# EAGLE schematic TSOC_NEOLED_R1_2 (EAGLE 6.6.0)
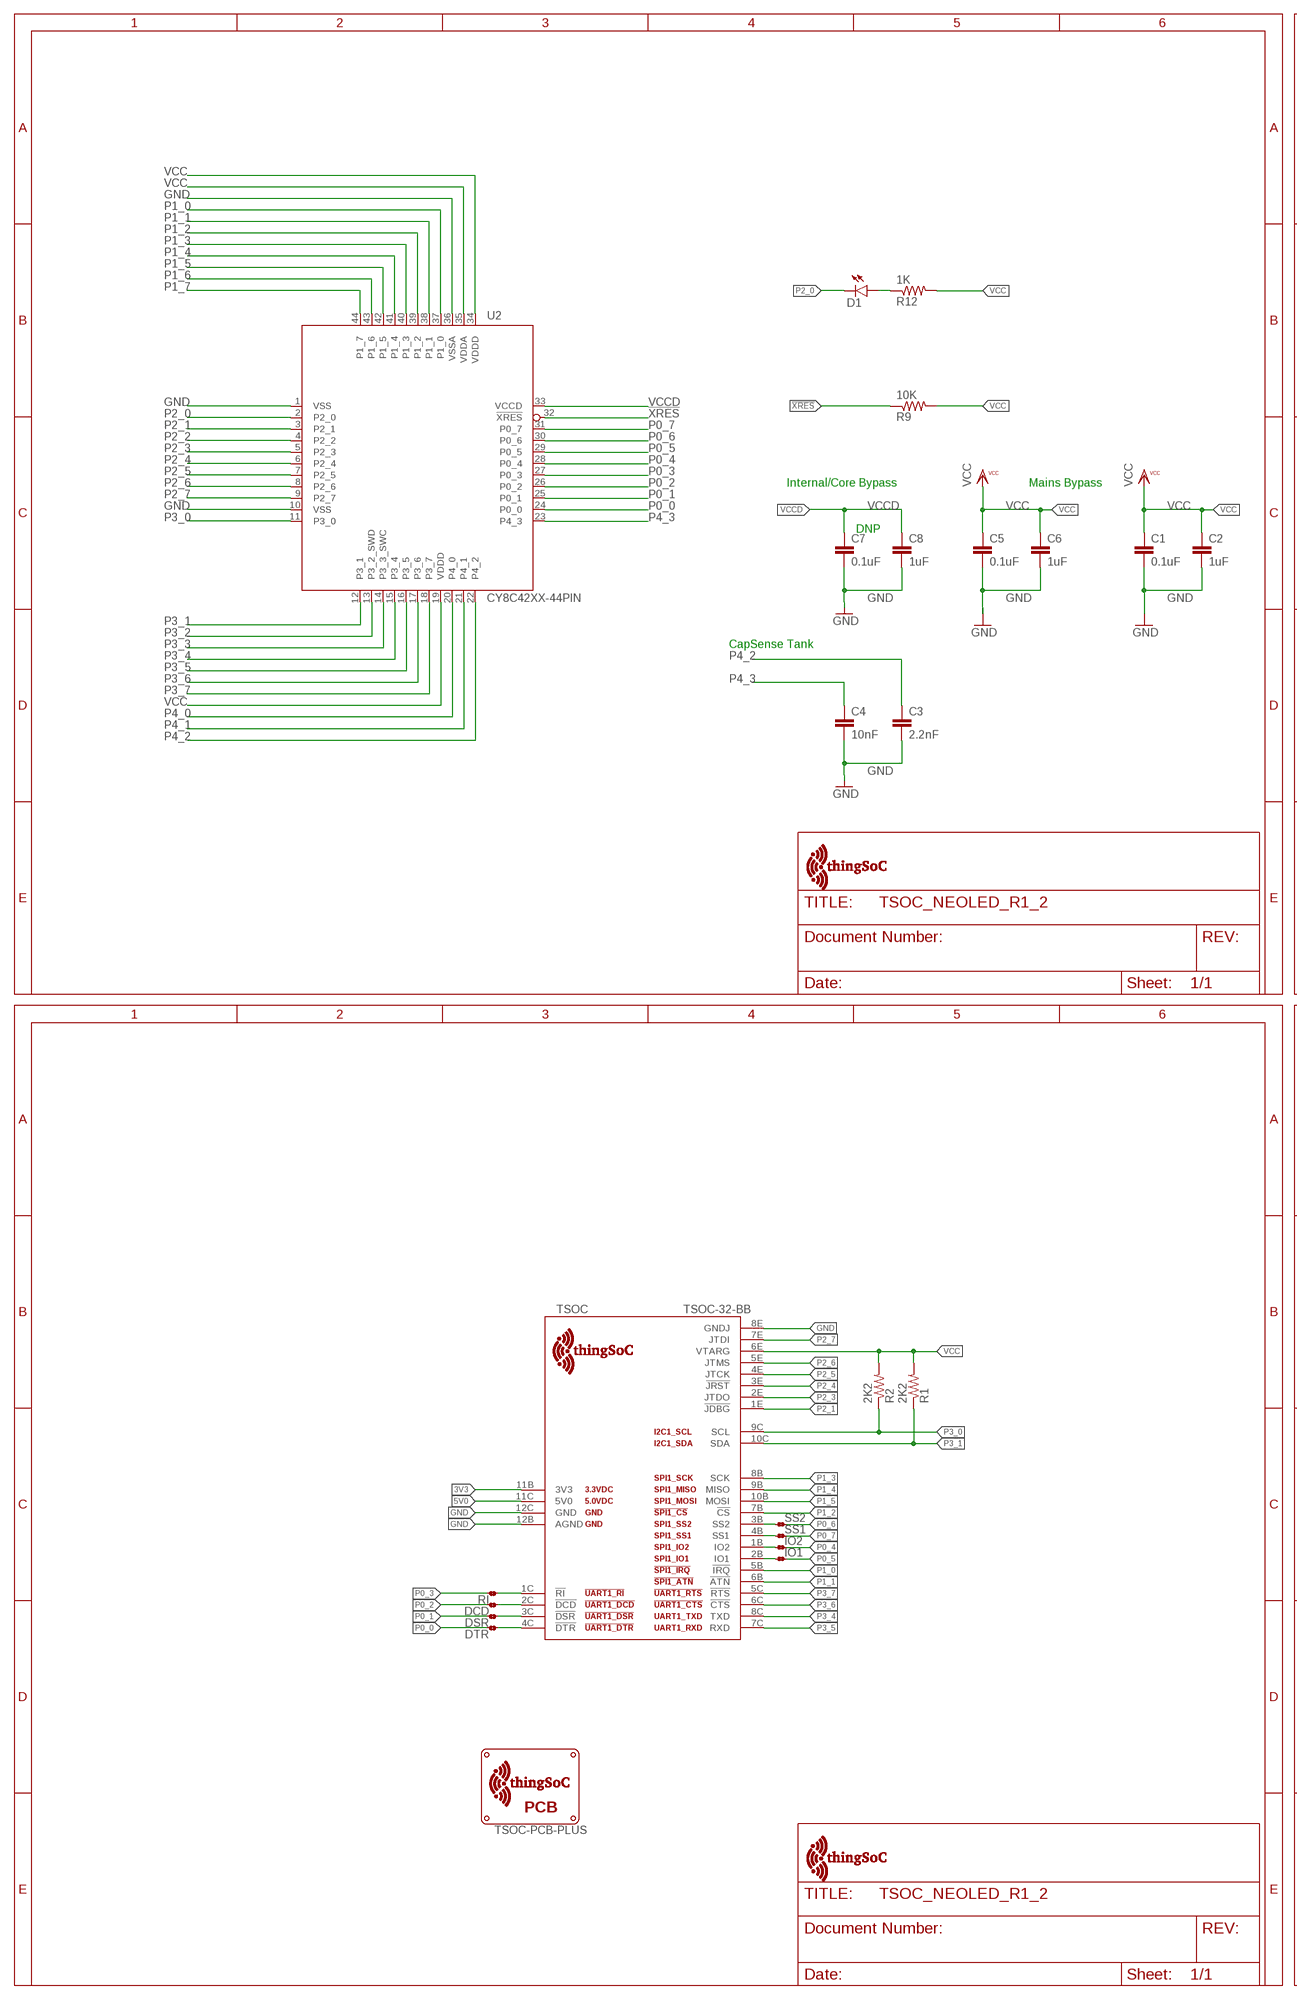
[diagram p0: schematic, sheet 1, part 1 of 2]
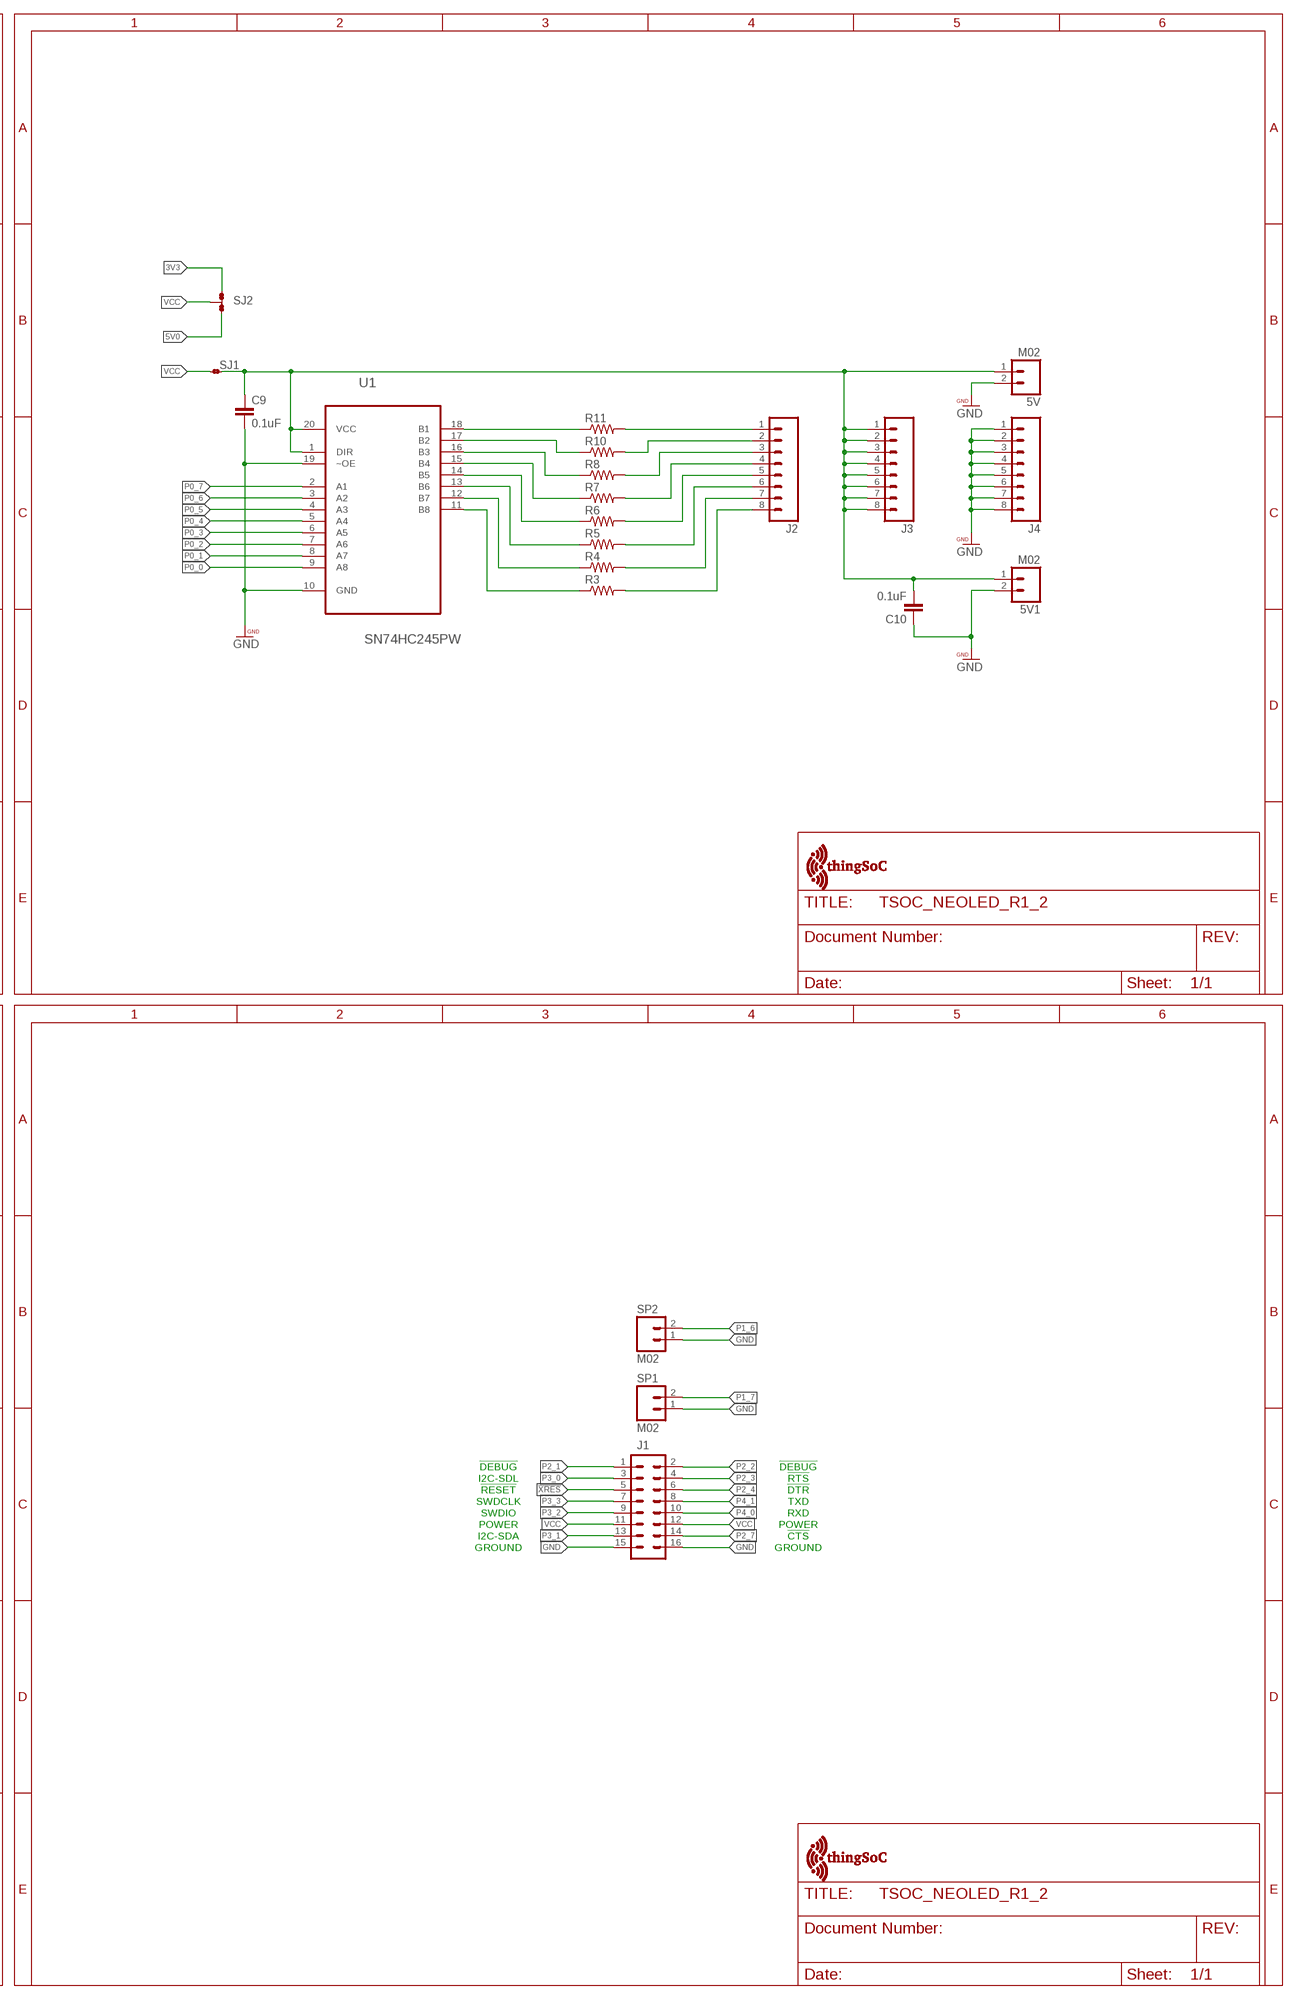
[diagram p1: schematic, sheet 1, part 2 of 2]

## Parts
5V  M02  [1X02]
5V1  M02  [1X02]
$$U$1  TSOC-LOGO-SMALL  [TSOC-LOGO-SML]
$$U$2  TSOC-LOGO-MED  [TSOC-LOGO-MED]
C1  0.1uF  CAP0603-CAP  [0603-CAP]
C2  1uF  CAP0603-CAP  [0603-CAP]
C3  2.2nF  CAP0603-CAP  [0603-CAP]
C4  10nF  CAP0603-CAP  [0603-CAP]
C5  0.1uF  CAP0603-CAP  [0603-CAP]
C6  1uF  CAP0603-CAP  [0603-CAP]
C7  0.1uF  CAP0603-CAP  [0603-CAP]
C8  1uF  CAP0603-CAP  [0603-CAP]
C9  0.1uF  CAP0603-CAP  [0603-CAP]
C10  0.1uF  CAP0603-CAP  [0603-CAP]
D1  LED0603  [LED-0603]
DCD  JMP-2-NO  [JMP-2-NO]
DSR  JMP-2-NO  [JMP-2-NO]
DTR  JMP-2-NO  [JMP-2-NO]
IO1  JMP-2-NO  [JMP-2-NO]
IO2  JMP-2-NO  [JMP-2-NO]
J1  M08X2  [2X8]
J2  M08  [1X08_ROUND]
J3  M08  [1X08_ROUND]
J4  M08  [1X08_ROUND]
R1  2K2  RESISTOR_SFE0603-RES  [0603-RES]
R2  2K2  RESISTOR_SFE0603-RES  [0603-RES]
R3  RESISTOR0603-RES  [0603-RES]
R4  RESISTOR0603-RES  [0603-RES]
R5  RESISTOR0603-RES  [0603-RES]
R6  RESISTOR0603-RES  [0603-RES]
R7  RESISTOR0603-RES  [0603-RES]
R8  RESISTOR0603-RES  [0603-RES]
R9  10K  RESISTOR_SFE0603-RES  [0603-RES]
R10  RESISTOR0603-RES  [0603-RES]
R11  RESISTOR0603-RES  [0603-RES]
R12  1K  RESISTOR_SFE0603-RES  [0603-RES]
RI  JMP-2-NO  [JMP-2-NO]
SJ1  JMP-2-NC  [JMP-2-NC]
SJ2  JMP-3-NC  [JMP-3-NC]
SP1  M02  [1X02]
SP2  M02  [1X02]
SS1  JMP-2-NO  [JMP-2-NO]
SS2  JMP-2-NO  [JMP-2-NO]
TSOC  TSOC-32-BB  [TSOC-BB-S32]
U1  SN74HC245PW  [SOP65P640X120-20N]
U2  CY8C42XX-44PIN  [TQFP-10X10-44]
U$1  TSOC-PCB-PLUS  [TSOC-BB-BRD-PLUS]
U$100  TSOC-LOGO-SMALL  [TSOC-LOGO-SML]
U$101  TSOC-LOGO-LRG  [TSOC-LOGO-LRG]

## Nets
3V3: SJ2.1 TSOC.11B(3V3)
5V0: SJ2.3 TSOC.11C(5V0)
!DCD: DCD.1 TSOC.2C(!DCD)
!DSR: DSR.1 TSOC.3C(!DSR)
!DTR: DTR.1 TSOC.4C(!DTR)
!R!: RI.1 TSOC.1C(!RI)
!XRES: J1.5 R9.1 U2.32(!XRES)
GND: 5V1.2 5V.2 C1.2 C2.2 C3.2 C4.2 C5.2 C6.2 C7.2 C8.2 C9.2 C10.1 J1.15 J1.16 J4.1 J4.2 J4.3 J4.4 J4.5 J4.6 J4.7 J4.8 SP1.1 SP2.1 TSOC.8E(GNDJ) TSOC.12B(AGND) TSOC.12C(GND) U1.10(GND) U1.19(~OE) U2.1(VSS) U2.10(VSS) U2.36(VSSA)
IO1: IO1.1 TSOC.2B(IO1)
IO2: IO2.1 TSOC.1B(IO2)
N$1: J2.1 R11.2
N$2: J2.2 R10.2
N$3: J2.3 R8.2
N$4: J2.4 R7.2
N$5: J2.5 R6.2
N$6: J2.6 R5.2
N$7: J2.7 R4.2
N$8: J2.8 R3.2
N$9: R11.1 U1.18(B1)
N$10: R10.1 U1.17(B2)
N$11: R8.1 U1.16(B3)
N$12: R7.1 U1.15(B4)
N$13: R6.1 U1.14(B5)
N$14: R5.1 U1.13(B6)
N$15: R4.1 U1.12(B7)
N$16: R3.1 U1.11(B8)
N$17: D1.A R12.1
P0_0: DTR.2 U1.9(A8) U2.24(P0_0)
P0_1: DSR.2 U1.8(A7) U2.25(P0_1)
P0_2: DCD.2 U1.7(A6) U2.26(P0_2)
P0_3: RI.2 U1.6(A5) U2.27(P0_3)
P0_4: IO2.2 U1.5(A4) U2.28(P0_4)
P0_5: IO1.2 U1.4(A3) U2.29(P0_5)
P0_6: SS2.2 U1.3(A2) U2.30(P0_6)
P0_7: SS1.2 U1.2(A1) U2.31(P0_7)
P1_0: TSOC.5B(!IRQ) U2.37(P1_0)
P1_1: TSOC.6B(!ATN) U2.38(P1_1)
P1_2: TSOC.7B(!CS) U2.39(P1_2)
P1_3: TSOC.8B(SCK) U2.40(P1_3)
P1_4: TSOC.9B(MISO) U2.41(P1_4)
P1_5: TSOC.10B(MOSI) U2.42(P1_5)
P1_6: SP2.2 U2.43(P1_6)
P1_7: SP1.2 U2.44(P1_7)
P2_0: D1.C U2.2(P2_0)
P2_1: J1.1 TSOC.1E(!JDBG) U2.3(P2_1)
P2_2: J1.2 U2.4(P2_2)
P2_3: J1.4 TSOC.2E(JTDO) U2.5(P2_3)
P2_4: J1.6 TSOC.3E(!JRST) U2.6(P2_4)
P2_5: TSOC.4E(JTCK) U2.7(P2_5)
P2_6: TSOC.5E(JTMS) U2.8(P2_6)
P2_7: J1.14 TSOC.7E(JTDI) U2.9(P2_7)
P3_0: J1.3 R2.1 TSOC.9C(SCL) U2.11(P3_0)
P3_1: J1.13 R1.1 TSOC.10C(SDA) U2.12(P3_1)
P3_2: J1.9 U2.13(P3_2_SWD)
P3_3: J1.7 U2.14(P3_3_SWC)
P3_4: TSOC.8C(TXD) U2.15(P3_4)
P3_5: TSOC.7C(RXD) U2.16(P3_5)
P3_6: TSOC.6C(!CTS) U2.17(P3_6)
P3_7: TSOC.5C(!RTS) U2.18(P3_7)
P4_0: J1.10 U2.20(P4_0)
P4_1: J1.8 U2.21(P4_1)
P4_2: C3.1 U2.22(P4_2)
P4_3: C4.1 U2.23(P4_3)
SS1: SS1.1 TSOC.4B(SS1)
SS2: SS2.1 TSOC.3B(SS2)
VCC: C1.1 C2.1 C5.1 C6.1 J1.11 J1.12 R1.2 R2.2 R9.2 R12.2 SJ1.1 SJ2.2 TSOC.6E(VTARG) U2.19(VDDD) U2.34(VDDD) U2.35(VDDA)
VCCD: C7.1 C8.1 U2.33(VCCD)
VEXT: 5V1.1 5V.1 C9.1 C10.2 J3.1 J3.2 J3.3 J3.4 J3.5 J3.6 J3.7 J3.8 SJ1.2 U1.1(DIR) U1.20(VCC)

## Notes on the sheet
- Internal/Core Bypass | Mains Bypass
- DNP
- CapSense Tank
- !DEBUG | !DEBUG
- I2C-SDL | !RTS
- !RESET | !DTR
- SWDCLK | TXD
- SWDIO | RXD
- POWER | POWER
- I2C-SDA | !CTS
- GROUND | GROUND

## Library data of the parts
5V 5V1 SP1 SP2 = PatternAgents-ProtoPads:M02
$$U$1 $$U$2 U$100 U$101 = thingSoC:TSOC-LOGO: thingSoC Logo Source LBR : http://www.thingsoc.com Github : https://github.com/thingsoc License : http://creativecommons.org/licenses/by-sa/4.0/ (Creative Commons 4.0) THIS SOFTWARE IS PROVIDED BY THE CONTRIBUTORS "AS IS" AND WITHOUT ANY EXPRESS OR IMPLIED WARRANTIES, INCLUDING, BUT NOT LIMITED TO, THE IMPLIED WARRANTIES OF MERCHANTABILITY AND FITNESS FOR A PARTICULAR PURPOSE ARE DISCLAIMED. IN NO EVENT SHALL THE COPYRIGHT OWNER OR CONTRIBUTORS BE LIABLE FOR ANY DIRECT, INDIRECT, INCIDENTAL, SPECIAL, EXEMPLARY, OR CONSEQUENTIAL DAMAGES (INCLUDING, BUT NOT LIMITED TO, PROCUREMENT OF SUBSTITUTE GOODS OR SERVICES; LOSS OF USE, DATA, OR PROFITS; OR BUSINESS INTERRUPTION) HOWEVER CAUSED AND ON ANY THEORY OF LIABILITY, WHETHER IN CONTRACT, STRICT LIABILITY, OR TORT (INCLUDING NEGLIGENCE OR OTHERWISE) ARISING IN ANY WAY OUT OF THE USE OF THIS SOFTWARE, EVEN IF ADVISED OF THE POSSIBILITY OF SUCH DAMAGE.
C1-C10 = PatternAgents-Misc:CAP: Capacitor Standard 0603 ceramic capacitor, and 0.1" leaded capacitor.
D1 = TSOC-ESP8266-BASE:LED: LEDs Standard schematic elements and footprints for 5mm, 3mm, 1206, and 0603 sized LEDs. 5mm - Spark Fun Electronics SKU : COM-00529 (and others)
DCD DSR DTR IO1 IO2 RI SS1 SS2 = PatternAgents-ProtoPads:JMP-2-NO: Two Terminal Jumper - Normally Open Positions 1 and 2 are normally NOT connected. PatternAgents ProtoPads Library Schematic and PCB layout libraries for design patterns by PatternAgents. For the CADSoft Eagle CAD program : http://www.cadsoftusa.com/download-eagle/ Source LBR : http://www.patternagents.com Github : https://github.com/PatternAgents License : http://creativecommons.org/licenses/by-sa/4.0/ (Creative Commons 4.0) THIS SOFTWARE IS PROVIDED BY THE CONTRIBUTORS "AS IS" AND WITHOUT ANY EXPRESS OR IMPLIED WARRANTIES, INCLUDING, BUT NOT LIMITED TO, THE IMPLIED WARRANTIES OF MERCHANTABILITY AND FITNESS FOR A PARTICULAR PURPOSE ARE DISCLAIMED. IN NO EVENT SHALL THE COPYRIGHT OWNER OR CONTRIBUTORS BE LIABLE FOR ANY DIRECT, INDIRECT, INCIDENTAL, SPECIAL, EXEMPLARY, OR CONSEQUENTIAL DAMAGES (INCLUDING, BUT NOT LIMITED TO, PROCUREMENT OF SUBSTITUTE GOODS OR SERVICES; LOSS OF USE, DATA, OR PROFITS; OR BUSINESS INTERRUPTION) HOWEVER CAUSED AND ON ANY THEORY OF LIABILITY, WHETHER IN CONTRACT, STRICT LIABILITY, OR TORT (INCLUDING NEGLIGENCE OR OTHERWISE) ARISING IN ANY WAY OUT OF THE USE OF THIS SOFTWARE, EVEN IF ADVISED OF THE POSSIBILITY OF SUCH DAMAGE.; BOM: EXCLUDE
J1 = PatternAgents-ProtoPads:M08X2: .1" headers, two rows of 8 each
J2-J4 = PatternAgents-ProtoPads:M08: Header 8 Standard 8-pin 0.1" header
R1 R2 R9 R12 = PatternAgents-Misc:RESISTOR_SFE: Resistor Basic schematic elements and footprints for 0603, 1206, and PTH resistors.
R3-R8 R10 R11 = PatternAgents-ProtoPads:RESISTOR: Resistor Basic schematic elements and footprints for 0603, 1206, and PTH resistors.
SJ1 = PatternAgents-ProtoPads:JMP-2-NC: Two Terminal Jumper - Normally Closed Positions 1 and 2 are normally connected. PatternAgents ProtoPads Library Schematic and PCB layout libraries for design patterns by PatternAgents. For the CADSoft Eagle CAD program : http://www.cadsoftusa.com/download-eagle/ Source LBR : http://www.patternagents.com Github : https://github.com/PatternAgents License : http://creativecommons.org/licenses/by-sa/4.0/ (Creative Commons 4.0) THIS SOFTWARE IS PROVIDED BY THE CONTRIBUTORS "AS IS" AND WITHOUT ANY EXPRESS OR IMPLIED WARRANTIES, INCLUDING, BUT NOT LIMITED TO, THE IMPLIED WARRANTIES OF MERCHANTABILITY AND FITNESS FOR A PARTICULAR PURPOSE ARE DISCLAIMED. IN NO EVENT SHALL THE COPYRIGHT OWNER OR CONTRIBUTORS BE LIABLE FOR ANY DIRECT, INDIRECT, INCIDENTAL, SPECIAL, EXEMPLARY, OR CONSEQUENTIAL DAMAGES (INCLUDING, BUT NOT LIMITED TO, PROCUREMENT OF SUBSTITUTE GOODS OR SERVICES; LOSS OF USE, DATA, OR PROFITS; OR BUSINESS INTERRUPTION) HOWEVER CAUSED AND ON ANY THEORY OF LIABILITY, WHETHER IN CONTRACT, STRICT LIABILITY, OR TORT (INCLUDING NEGLIGENCE OR OTHERWISE) ARISING IN ANY WAY OUT OF THE USE OF THIS SOFTWARE, EVEN IF ADVISED OF THE POSSIBILITY OF SUCH DAMAGE.; BOM: EXCLUDE
SJ2 = PatternAgents-ProtoPads:JMP-3-NC: Three Terminal Jumper - ALL Connected Positions 1, 2, and 3 are normally connected. PatternAgents ProtoPads Library Schematic and PCB layout libraries for design patterns by PatternAgents. For the CADSoft Eagle CAD program : http://www.cadsoftusa.com/download-eagle/ Source LBR : http://www.patternagents.com Github : https://github.com/PatternAgents License : http://creativecommons.org/licenses/by-sa/4.0/ (Creative Commons 4.0) THIS SOFTWARE IS PROVIDED BY THE CONTRIBUTORS "AS IS" AND WITHOUT ANY EXPRESS OR IMPLIED WARRANTIES, INCLUDING, BUT NOT LIMITED TO, THE IMPLIED WARRANTIES OF MERCHANTABILITY AND FITNESS FOR A PARTICULAR PURPOSE ARE DISCLAIMED. IN NO EVENT SHALL THE COPYRIGHT OWNER OR CONTRIBUTORS BE LIABLE FOR ANY DIRECT, INDIRECT, INCIDENTAL, SPECIAL, EXEMPLARY, OR CONSEQUENTIAL DAMAGES (INCLUDING, BUT NOT LIMITED TO, PROCUREMENT OF SUBSTITUTE GOODS OR SERVICES; LOSS OF USE, DATA, OR PROFITS; OR BUSINESS INTERRUPTION) HOWEVER CAUSED AND ON ANY THEORY OF LIABILITY, WHETHER IN CONTRACT, STRICT LIABILITY, OR TORT (INCLUDING NEGLIGENCE OR OTHERWISE) ARISING IN ANY WAY OUT OF THE USE OF THIS SOFTWARE, EVEN IF ADVISED OF THE POSSIBILITY OF SUCH DAMAGE.; BOM: EXCLUDE
TSOC = thingSoC:TSOC-32: thingSoC Thirty-Two (32) Pin Socket Source LBR : http://www.thingsoc.com Github : https://github.com/thingsoc License : http://creativecommons.org/licenses/by-sa/4.0/ (Creative Commons 4.0) THIS SOFTWARE IS PROVIDED BY THE CONTRIBUTORS "AS IS" AND WITHOUT ANY EXPRESS OR IMPLIED WARRANTIES, INCLUDING, BUT NOT LIMITED TO, THE IMPLIED WARRANTIES OF MERCHANTABILITY AND FITNESS FOR A PARTICULAR PURPOSE ARE DISCLAIMED. IN NO EVENT SHALL THE COPYRIGHT OWNER OR CONTRIBUTORS BE LIABLE FOR ANY DIRECT, INDIRECT, INCIDENTAL, SPECIAL, EXEMPLARY, OR CONSEQUENTIAL DAMAGES (INCLUDING, BUT NOT LIMITED TO, PROCUREMENT OF SUBSTITUTE GOODS OR SERVICES; LOSS OF USE, DATA, OR PROFITS; OR BUSINESS INTERRUPTION) HOWEVER CAUSED AND ON ANY THEORY OF LIABILITY, WHETHER IN CONTRACT, STRICT LIABILITY, OR TORT (INCLUDING NEGLIGENCE OR OTHERWISE) ARISING IN ANY WAY OUT OF THE USE OF THIS SOFTWARE, EVEN IF ADVISED OF THE POSSIBILITY OF SUCH DAMAGE.
U1 = PatternAgents-TI:SN74HC245PW: OCTAL BUS TRANSCEIVERS; MPN: SN74HC245PW; OC_FARNELL: 1236221; OC_NEWARK: 13M5213; PACKAGE: TSSOP-20; SUPPLIER: Texas Instruments
U2 = PatternAgents-Cypress:CY8C42XX-44PIN: Cypress PSoC® 4 - Programmable System on Chip, Cortex-M0 Based http://www.cypress.com/?mpn=CY8C4245AXI-483 LBR Source: http://www.patternagents.com THIS SOFTWARE IS PROVIDED BY THE CONTRIBUTORS "AS IS" AND WITHOUT ANY EXPRESS OR IMPLIED WARRANTIES, INCLUDING, BUT NOT LIMITED TO, THE IMPLIED WARRANTIES OF MERCHANTABILITY AND FITNESS FOR A PARTICULAR PURPOSE ARE DISCLAIMED. IN NO EVENT SHALL THE COPYRIGHT OWNER OR CONTRIBUTORS BE LIABLE FOR ANY DIRECT, INDIRECT, INCIDENTAL, SPECIAL, EXEMPLARY, OR CONSEQUENTIAL DAMAGES (INCLUDING, BUT NOT LIMITED TO, PROCUREMENT OF SUBSTITUTE GOODS OR SERVICES; LOSS OF USE, DATA, OR PROFITS; OR BUSINESS INTERRUPTION) HOWEVER CAUSED AND ON ANY THEORY OF LIABILITY, WHETHER IN CONTRACT, STRICT LIABILITY, OR TORT (INCLUDING NEGLIGENCE OR OTHERWISE) ARISING IN ANY WAY OUT OF THE USE OF THIS SOFTWARE, EVEN IF ADVISED OF THE POSSIBILITY OF SUCH DAMAGE.
U$1 = thingSoC:TSOC-PCB: thingSoC PCB Outlines Boards Outlines for Standard Sizes (in the DImension Layer) (Registration marks in the tDocu layer - make sure to turn on tDocu/bDocu) Source LBR : http://www.thingsoc.com Github : https://github.com/thingsoc License : http://creativecommons.org/licenses/by-sa/4.0/ (Creative Commons 4.0) THIS SOFTWARE IS PROVIDED BY THE CONTRIBUTORS "AS IS" AND WITHOUT ANY EXPRESS OR IMPLIED WARRANTIES, INCLUDING, BUT NOT LIMITED TO, THE IMPLIED WARRANTIES OF MERCHANTABILITY AND FITNESS FOR A PARTICULAR PURPOSE ARE DISCLAIMED. IN NO EVENT SHALL THE COPYRIGHT OWNER OR CONTRIBUTORS BE LIABLE FOR ANY DIRECT, INDIRECT, INCIDENTAL, SPECIAL, EXEMPLARY, OR CONSEQUENTIAL DAMAGES (INCLUDING, BUT NOT LIMITED TO, PROCUREMENT OF SUBSTITUTE GOODS OR SERVICES; LOSS OF USE, DATA, OR PROFITS; OR BUSINESS INTERRUPTION) HOWEVER CAUSED AND ON ANY THEORY OF LIABILITY, WHETHER IN CONTRACT, STRICT LIABILITY, OR TORT (INCLUDING NEGLIGENCE OR OTHERWISE) ARISING IN ANY WAY OUT OF THE USE OF THIS SOFTWARE, EVEN IF ADVISED OF THE POSSIBILITY OF SUCH DAMAGE.